# Altium schematic sheet 3 - Periphery.SchDoc: Atmel Energy Metering Demo Board
size A3; DrawnBy: Felix Yao; Organization: Smart Energy; Revision: 1.0; SheetNumber: 3; SheetTotal: 3; PageSetup: Record=PageOptions|CenterHorizontal=True|CenterVertical=True|PrintScale=0.71|XCorrection=1.00|YCorrection=1.00|PrintKind=1|BorderSize=5000000|LeftOffset=0|BottomOffset=0|Orientation=2|PaperLength=1000|PaperWidth=1000|Scale=100|PaperSource=7|PrintQuality=-4|MediaType=1|DitherType=10|PaperKind=A4 (210 x 297 mm)|PrintScaleMode=1
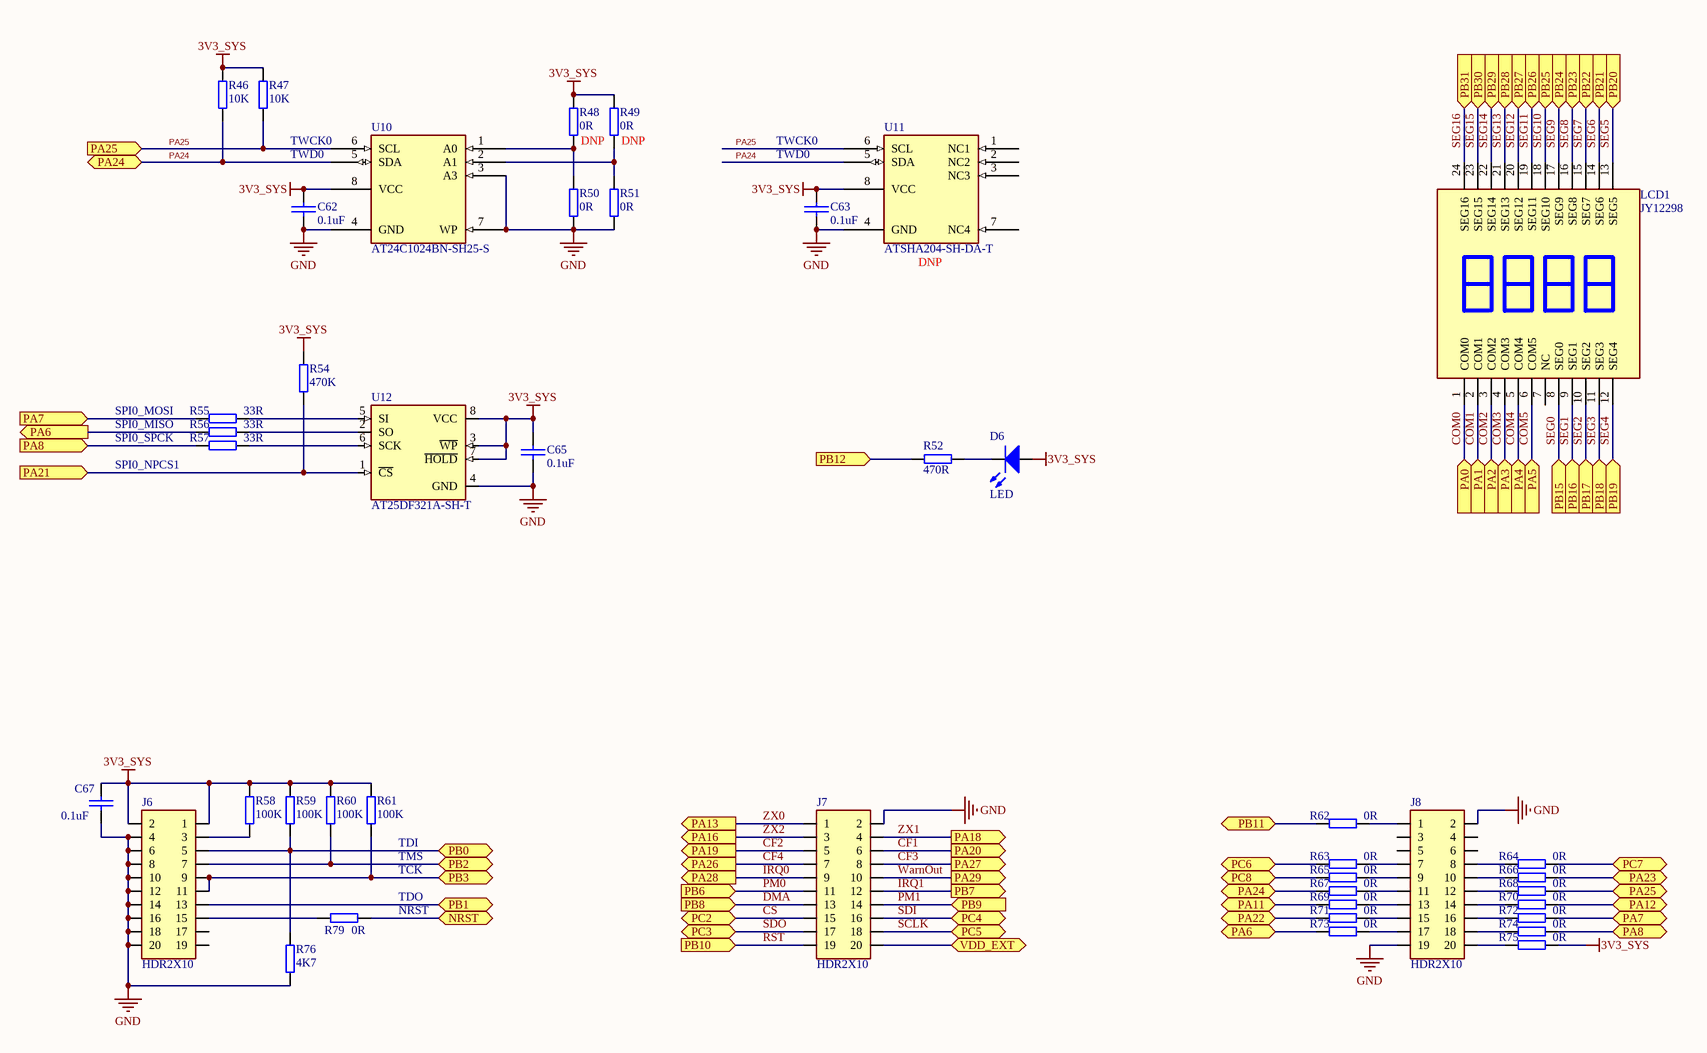
[diagram p0: 3 - Periphery.SchDoc]

## Parts
C62  0.1uF  [C0603]
C63  0.1uF  [C0603]
C65  0.1uF  [C0603]
C67  0.1uF  [C0603]
D6  LED  [LED-0805G]
J6  HDR2X10  [HDR2X10]
J7  HDR2X10  [HDR2X10]
J8  HDR2X10  [HDR2X10]
LCD1  JY12298  [LCD_JY12298]
R46  10K  [R0603]
R47  10K  [R0603]
R48  0R  [R0603]
R49  0R  [R0603]
R50  0R  [R0603]
R51  0R  [R0603]
R52  470R  [R0603]
R54  470K  [R0603]
R55  33R  [R0603]
R56  33R  [R0603]
R57  33R  [R0603]
R58  100K  [R0603]
R59  100K  [R0603]
R60  100K  [R0603]
R61  100K  [R0603]
R62  0R  [R0603]
R63  0R  [R0603]
R64  0R  [R0603]
R65  0R  [R0603]
R66  0R  [R0603]
R67  0R  [R0603]
R68  0R  [R0603]
R69  0R  [R0603]
R70  0R  [R0603]
R71  0R  [R0603]
R72  0R  [R0603]
R73  0R  [R0603]
R74  0R  [R0603]
R75  0R  [R0603]
R76  4K7  [R0603]
R79  0R  [R0603]
U10  AT24C1024BN-SH25-S  [SO8]
U11  ATSHA204-SH-DA-T  [SO8]
U12  AT25DF321A-SH-T  [SOIC8]

## Ports
NRST (bidir), PA0 (in), PA1 (in), PA2 (in), PA3 (in), PA4 (in), PA5 (in), PA6 (bidir), PA6 (out), PA7 (bidir), PA7 (in), PA8 (bidir), PA8 (in), PA11 (bidir), PA12 (bidir), PA13 (out), PA16 (out), PA18 (out), PA19 (out), PA20 (out), PA21 (in), PA22 (bidir), PA23 (bidir), PA24 (bidir), PA25 (bidir), PA25 (in), PA26 (out), PA27 (out), PA28 (out), PA29 (out), PB0 (bidir), PB1 (bidir), PB2 (bidir), PB3 (bidir), PB6 (in), PB7 (out), PB8 (in), PB9 (in), PB10 (in), PB11 (bidir), PB12 (in), PB15 (in), PB16 (in), PB17 (in), PB18 (in), PB19 (in), PB20 (in), PB21 (in), PB22 (in), PB23 (in), PB24 (in), PB25 (in), PB26 (in), PB27 (in), PB28 (in), PB29 (in), PB30 (in), PB31 (in), PC2 (bidir), PC3 (bidir), PC4 (bidir), PC5 (bidir), PC6 (bidir), PC7 (bidir), PC8 (bidir), VDD_EXT (bidir)

## Nets
3V3_SYS: C62.2 C63.2 C65.2 C67.2 D6.A J6.1 J6.2 R46.2 R47.2 R48.2 R49.2 R54.2 R58.2 R59.2 R60.2 R61.2 R75.2 U10.8(VCC) U11.8(VCC) U12.3(~{WP}) U12.7(~{HOLD}) U12.8(VCC)
GND: C62.1 C63.1 C65.1 C67.1 J6.4 J6.6 J6.8 J6.10 J6.12 J6.14 J6.16 J6.18 J6.20 J7.2 J8.2 J8.19 R50.1 R51.1 R76.1 U10.3(A3) U10.4(GND) U10.7(WP) U11.4(GND) U12.4(GND)
CF1: J7.6 ; port PA20
CF2: J7.5 ; port PA19
CF3: J7.8 ; port PA27
CF4: J7.7 ; port PA26
COM0: LCD1.1(COM0) ; port PA0
COM1: LCD1.2(COM1) ; port PA1
COM2: LCD1.3(COM2) ; port PA2
COM3: LCD1.4(COM3) ; port PA3
COM4: LCD1.5(COM4) ; port PA4
COM5: LCD1.6(COM5) ; port PA5
CS: J7.15 ; port PC2
DMA: J7.13 ; port PB8
IRQ0: J7.9 ; port PA28
IRQ1: J7.12 ; port PB7
NRST: R79.2 ; port NRST
PA6: R56.1 R73.1 ; port PA6
PA7: R55.1 R72.2 ; port PA7
PA8: R57.1 R74.2 ; port PA8
PA11: R69.1 ; port PA11
PA12: R70.2 ; port PA12
PA21: R54.1 U12.1(~{CS}) ; port PA21
PA22: R71.1 ; port PA22
PA23: R66.2 ; port PA23
PA24: R46.1 R67.1 U10.5(SDA) U11.5(SDA) ; port PA24
PA25: R47.1 R68.2 U10.6(SCL) U11.6(SCL) ; port PA25
PB0: J6.5 R59.1 R76.2 ; port PB0
PB1: J6.13 ; port PB1
PB2: J6.7 R60.1 ; port PB2
PB3: J6.9 J6.11 R61.1 ; port PB3
PB11: R62.1 ; port PB11
PB12: R52.1 ; port PB12
PC6: R63.1 ; port PC6
PC7: R64.2 ; port PC7
PC8: R65.1 ; port PC8
PM0: J7.11 ; port PB6
PM1: J7.14 ; port PB9
RST: J7.19 ; port PB10
SCLK: J7.18 ; port PC5
SDI: J7.16 ; port PC4
SDO: J7.17 ; port PC3
SEG0: LCD1.8(SEG0) ; port PB15
SEG1: LCD1.9(SEG1) ; port PB16
SEG2: LCD1.10(SEG2) ; port PB17
SEG3: LCD1.11(SEG3) ; port PB18
SEG4: LCD1.12(SEG4) ; port PB19
SEG5: LCD1.13(SEG5) ; port PB20
SEG6: LCD1.14(SEG6) ; port PB21
SEG7: LCD1.15(SEG7) ; port PB22
SEG8: LCD1.16(SEG8) ; port PB23
SEG9: LCD1.17(SEG9) ; port PB24
SEG10: LCD1.18(SEG10) ; port PB25
SEG11: LCD1.19(SEG11) ; port PB26
SEG12: LCD1.20(SEG12) ; port PB27
SEG13: LCD1.21(SEG13) ; port PB28
SEG14: LCD1.22(SEG14) ; port PB29
SEG15: LCD1.23(SEG15) ; port PB30
SEG16: LCD1.24(SEG16) ; port PB31
VDD_EXT: J7.20 ; port VDD_EXT
WarnOut: J7.10 ; port PA29
ZX0: J7.1 ; port PA13
ZX1: J7.4 ; port PA18
ZX2: J7.3 ; port PA16
NetD6_K: D6.K R52.2
NetJ6_3: J6.3 R58.1
NetJ6_15: J6.15 R79.1
NetJ8_1: J8.1 R62.2
NetJ8_7: J8.7 R63.2
NetJ8_8: J8.8 R64.1
NetJ8_9: J8.9 R65.2
NetJ8_10: J8.10 R66.1
NetJ8_11: J8.11 R67.2
NetJ8_12: J8.12 R68.1
NetJ8_13: J8.13 R69.2
NetJ8_14: J8.14 R70.1
NetJ8_15: J8.15 R71.2
NetJ8_16: J8.16 R72.1
NetJ8_17: J8.17 R73.2
NetJ8_18: J8.18 R74.1
NetJ8_20: J8.20 R75.1
NetR48_1: R48.1 R50.2 U10.1(A0)
NetR49_1: R49.1 R51.2 U10.2(A1)
NetR55_2: R55.2 U12.5(SI)
NetR56_2: R56.2 U12.2(SO)
NetR57_2: R57.2 U12.6(SCK)

Not connected (* = marked no-connect by the designer): J6 17 19; J8 3 4 5 6; LCD1 7(NC); U11 1(NC1) 2(NC2) 3(NC3) 7(NC4)

## Notes on the sheet
- TWCK0
- TWD0
- (near R48) DNP
- (near R49) DNP
- (near C63) TWD0
- (near U11) DNP
- SPI0_MOSI
- SPI0_MISO
- SPI0_SPCK
- SPI0_NPCS1
- (near R61) TDI
- (near R61) TMS
- TCK
- (near R79) TDO
- (near R79) NRST
- Atmel China
- DrawnBy:
- Document Number:
- CheckedBy:
- ApprovedBy:
- Page:
- Size:
- A3
- of
- Project:
- Date:
- File:
- Revision:
- Title:

## Library data of the parts
C62 C63 C65 C67 = CAP
LCD1 = LCD_JY12298: Display,FSTN,Positive,Reflective,JY12298,60.15x45.1mm; Manufacturer: 翼雅; Value: JY12298; Manufacturer Part Number: JY12298
R46-R52 R54-R76 R79 = RES
U10 = AT24C512BN-SH25-SO8_1: Two Wires Serial EEPROM; Manufacturer: Atmel; Manufacturer Part number: AT24C1024BN-SH25; Value: AT24C1024BN-SH25-S
U11 = ATSHA204-SH-DA-T: IC,CryptoAuthentication,ATSHA204-SH-DA-T; Manufacturer: ATMEL; Manufacturer Part number: ATSHA204-SH-DA-T; Value: ATSHA204-SH-DA-T
U12 = AT25DF321_SU: 32 Mb Serial DataFlash; Manufacturer: ATMEL; Manufacturer Part number: AT25DF321A-SH-T; Value: AT25DF321A-SH-T